# Altium project XTR111.PrjPcb
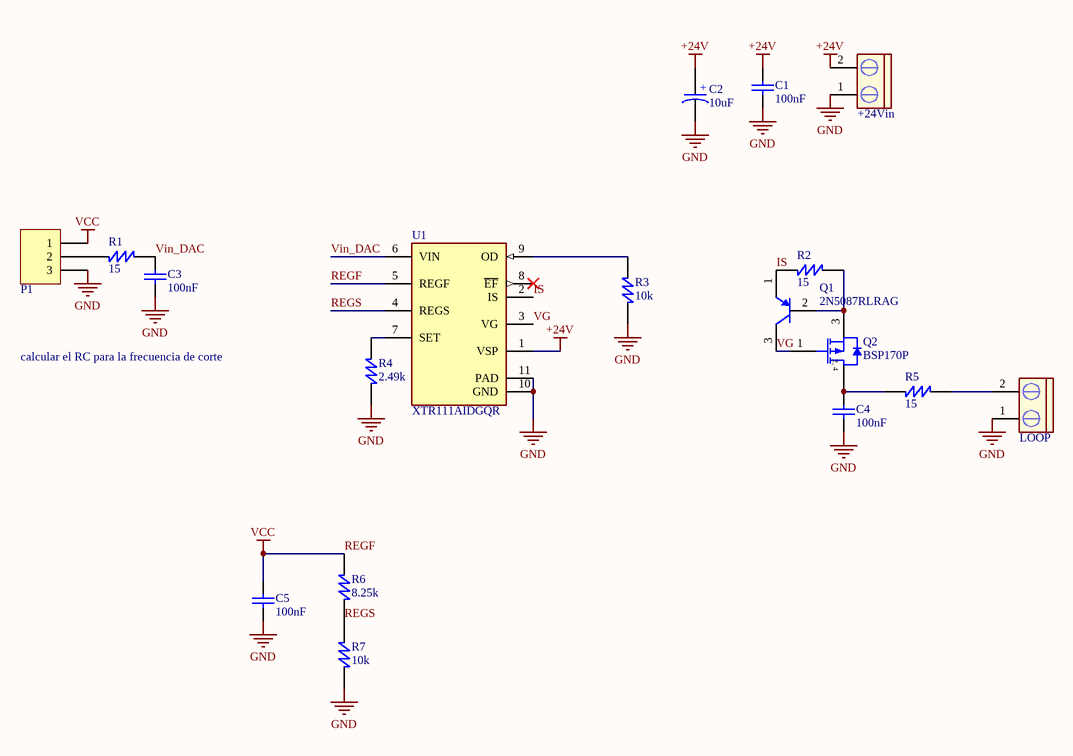
[diagram p0: XTR111_ES.SchDoc]
1 sheet, 18 parts. Net scope: global (net labels, ports and power ports of the same name join across sheets).
Board file: XTR111_PCB.PcbDoc

## Sheet XTR111_ES.SchDoc
size A4

### Parts
+24Vin  CON2 pin blue  [BORNE 2P]  (value not drawn)
C1  100nF  [CAP 1206]
C2  10uF  [CAPRADIAL 6.3X11 - 10u]
C3  100nF  [CAP 1206]
C4  100nF  [CAP 1206]
C5  100nF  [CAP 1206]
LOOP  CON2 pin blue  [BORNE 2P]  (value not drawn)
P1  Header 3  [1X03]  (value not drawn)
Q1  2N5087RLRAG  [ONSC-TO-92-3-29-11_AM_BL]
Q2  BSP170P  [INF-PG-SOT223_SC-73_N]
R1  value 15  [R1206 Negro]  (hidden comment: 1k)
R2  value 15  [R1206 Negro]  (hidden comment: 1k)
R3  value 10k  [R1206 Negro]  (hidden comment: 1k)
R4  value 2.49k  [R1206 Negro]  (hidden comment: 1k)
R5  value 15  [R1206 Negro]  (hidden comment: 1k)
R6  value 8.25k  [R1206 Negro]  (hidden comment: 1k)
R7  value 10k  [R1206 Negro]  (hidden comment: 1k)
U1  XTR111AIDGQR  [FP-DGQ0010D-MFG]

### Nets
+24V: +24Vin.2 C1.2 C2.1 U1.1(VSP)
GND: +24Vin.1 C1.1 C2.2 C3.1 C4.1 C5.1 LOOP.1 P1.3 R3.1 R4.1 R7.1 U1.10(GND) U1.11(PAD)
REGF: C5.2 P1.1 R6.2 U1.5(REGF)  [also labelled VCC]
IS: Q1.1(E) R2.2 U1.2(IS)
REGS: R6.1 R7.2 U1.4(REGS)
VG: Q1.3(C) Q2.1(GATE) U1.3(VG)
Vin_DAC: C3.2 R1.1 U1.6(VIN)
NetC4_2: C4.2 Q2.2(DRAIN) Q2.4(DRAIN) R5.2
NetLOOP_2: LOOP.2 R5.1
NetP1_2: P1.2 R1.2
NetQ1_2: Q1.2(B) Q2.3(SOURCE) R2.1
NetR3_2: R3.2 U1.9(OD)
NetR4_2: R4.2 U1.7(SET)

Not connected (* = marked no-connect by the designer): U1 8(~{EF})*

### Notes on the sheet
- calcular el RC para la frecuencia de corte
- (in symbol CAP ELECT) +
- (in symbol CMP-1099-00020-1) 2, 4

### Library data of the parts
+24Vin LOOP = CON2 pin blue: Connector blue screw
C1 C3-C5 = Cap ceramic: CAP-100nf / 0402B104K250CT -0603B104K250CT-0805B104K250CT-1206B104K250CT; PartNumber: 0402B104K250CT; Value: 100nF
C2 = CAP ELECT: CAP_AXIAL; PartNumber: *; Value: 10uF
P1 = Header 3: Header, 3-Pin; LatestRevisionDate: 17-Jul-2002; LatestRevisionNote: Re-released for DXP Platform.; Publisher: Altium Limited
Q1 = CMP-1048-01483-1: Amplifier Transistor, PNP Silicon, 3-Pin TO-92, Pb-Free, Tape and Reel; Manufacturer: On Semiconductor; fT Min (MHz): 40; IC Continuous (A): 0.05; ComponentLink1Description: Manufacturer URL; Packing: Tape and Reel; PackageDescription: 3-Pin Transistor Outline, Body 4.825 x 3.685 mm, Pitch 1.27 mm; ComponentLink3URL: http://www.onsemi.com/pub_link/Collateral/MAC97-D.PDF; RoHS: TRUE; ComponentLink2URL: http://www.onsemi.com/pub_link/Collateral/2N5087-D.PDF; PackageVersion: Rev. AM; Mounting Technology: Through Hole; Polarity: PNP; PartNumber: 2N5087RLRAG; DatasheetVersion: Rev. 5; ComponentLink1URL: http://www.onsemi.com/; ComponentLink2Description: Datasheet; ComponentLink3Description: Package Specification; PackageReference: TO-92-3-29-11_AM_BL
Q2 = CMP-1099-00020-1: P-Channel SIPMOS Small-Signal-Transistor, -60 V VDS, -1.9 A ID, -55 to 150 degC, PG-SOT223 (SC-73), Reel, Green; Manufacturer: Infineon; Pto t (max): 1.8Â mW; Polarity: P; VDS (max): -60Â V; RDS (on) (max): 300Â mOhm; IDpuls (max): -7.6Â A; Green: TRUE; Rth: 110Â K/W; VGS(th) (max): -4Â V; VGS(th) (min): -2.1Â V; ID (max): -1.9Â A; Mode: Enhancement; QG: -12.5Â nC; PackageVersion: Apr-08; PartNumber: BSP170P; ComponentLink1Description: Manufacturer URL; ComponentLink2Description: Datasheet; PackageReference: PG-SOT223 (SC-73); Mounting Technology: Surface Mount; ComponentLink2URL: http://www.infineon.com/dgdl/BSP170P_Rev2.53.pdf?folderId=db3a304314dca38901154a72e3951a65&fileId=db3a30433b47825b013b5fdad470576f; ComponentLink1URL: http://www.infineon.com/; ComponentLink3Description: Package Specification; Halogen-free: TRUE; Packing: Reel; Technology: SIPMOS; DatasheetVersion: Rev. 2.53; ComponentLink3URL: http://www.infineon.com/dgdl/SOT223-Package_Overview.pdf?folderId=db3a30431936bc4b0119530470b03c3d&fileId=db3a30431936bc4b0119531d40b93c5c; PackageDescription: 4-Pin Small Outline Transistor Package, 6.5 x 3.5 mm Body, 2.3 mm Pitch
R1-R7 = Res: resistor; PartNumber: *
U1 = CMP-04883-000001-1: IC PREC VOLT-CURR CONV/TX 10MSOP; Manufacturer: Texas Instruments; Nominal Supply Current: 450uA; Max Supply Voltage: 44V; Sensor Input: Analog Voltage; Min Supply Voltage: 7V; Standoff Height: 0.05mm; Sensor Type String: Current Transmitter; Ipc Land Pattern Name: SOP50P490X110-10; Octopart: https://octopart.com/xtr111aidgqr-texas+instruments-7116478; Device Class L3: Sensor and Detector Interfaces; Package: DGQ0010D; Digikey Description: IC PREC VOLT-CURR CONV/TX 10MSOP; Temperature: -40°C to +125°C; Device Class L1: Integrated Circuits (ICs); Device Class L2: Interface ICs; Mouser Description: Sensor Interface Prec Vltg-to-Crnt Conv/Transmitter; ComponentLink2URL: http://www.ti.com/lit/ds/symlink/xtr111.pdf; Sensor Output: Analog Voltage; Category: IC; Temperature Range Low: -40°C; Temperature Range High: +125°C; ComponentLink2Description: Datasheet; RoHS: TRUE; Lead Free: Yes; Automotive: No; Manufacturer Part Number: XTR111AIDGQR; Height: 1.1mm